# EasyEDA Pro project ProPrj_VL53L0X_1_2026-04-08.epro

# Schematic Schematic1
Create Date: 2026-04-06; Page Name: P1; Project Name: VL53L0X_1; Schematic Name: Schematic1; Update Date: 2026-04-07; Company: EasyEDA.com; Page Size: A4; Version: V1.0
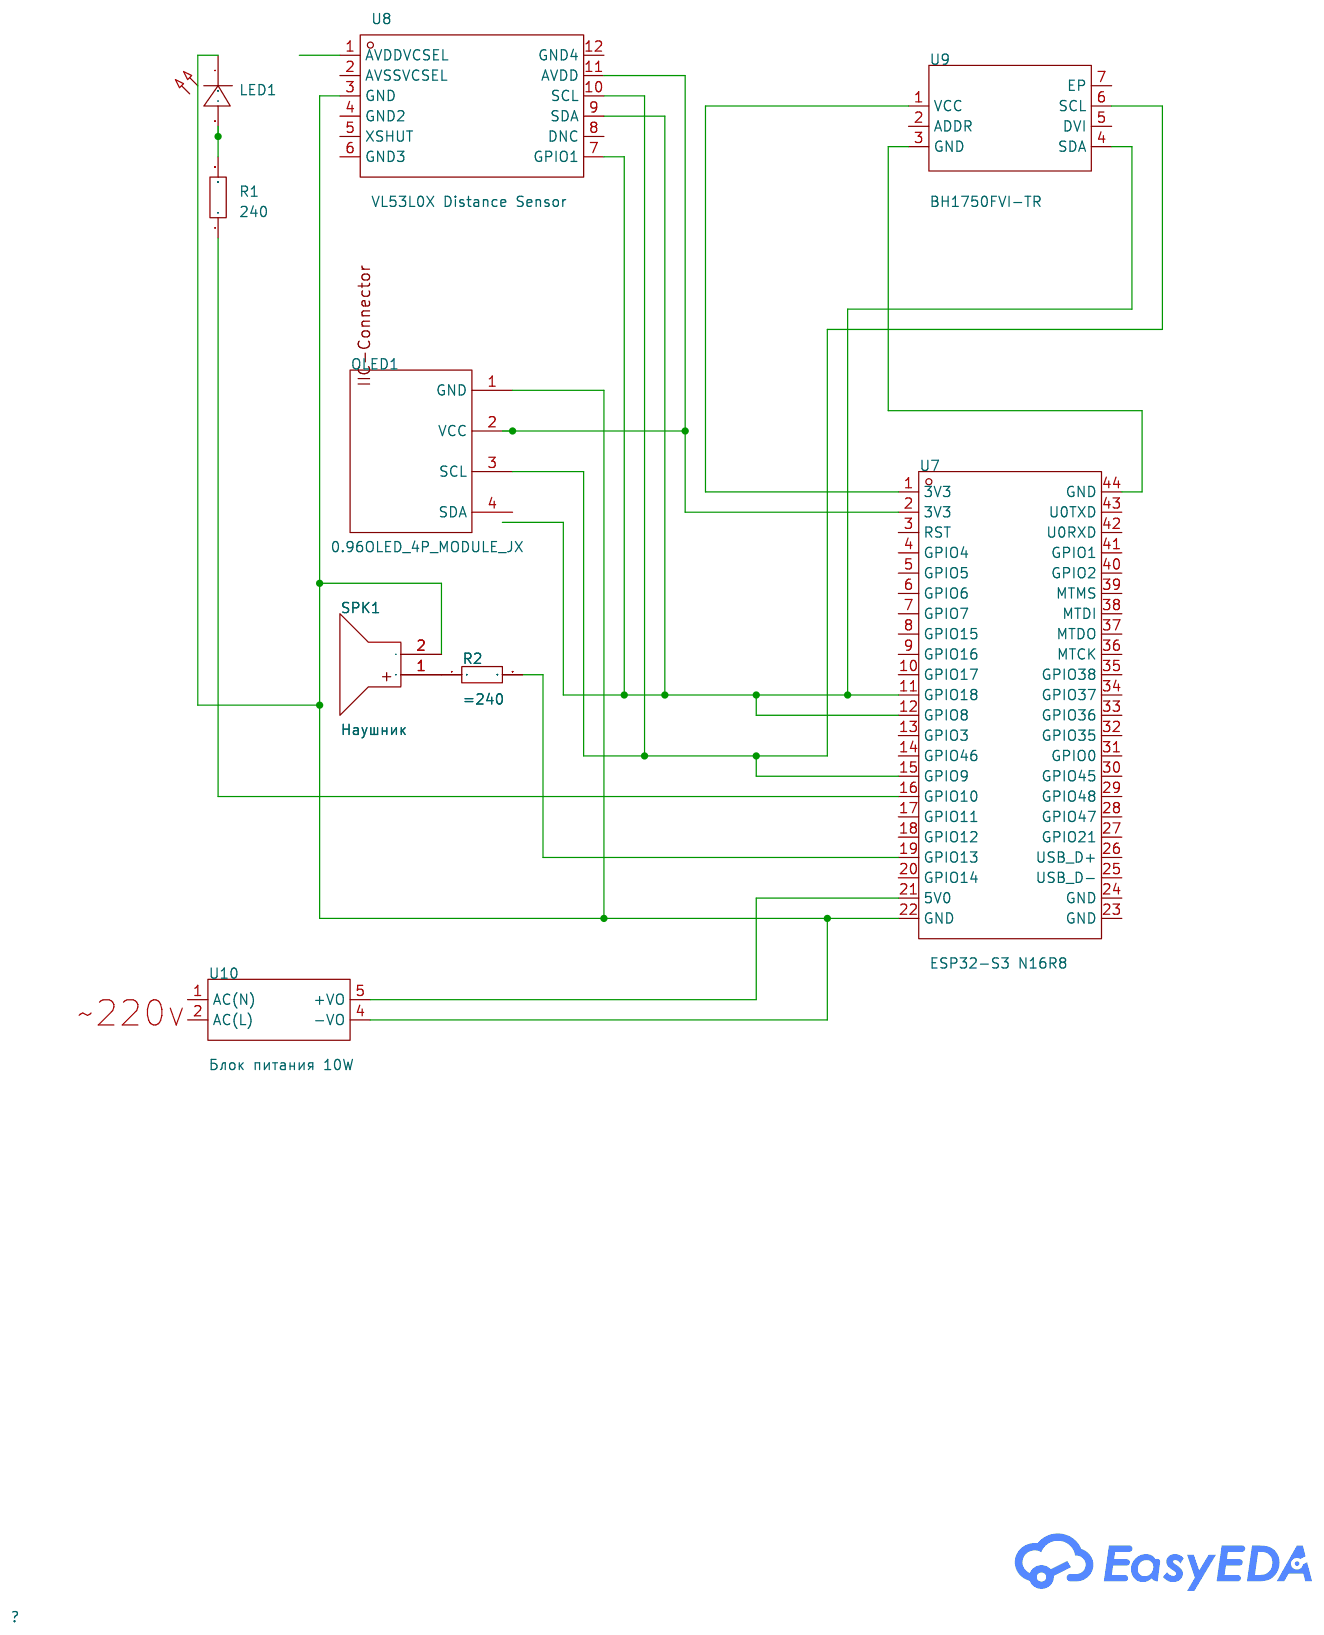
[diagram p0: schematic sheet]

## Parts
LED1  -  [LED0603-RD_GREEN]
OLED1  0.96OLED_4P_MODULE_JX  [0.96OLED_4P]
R1  10K  [R0603]
R2  10K  [R0603]
SPK1  Наушник  [SPK-TH_BD23.0-P10.00-D0.8-L-RD]
U7  ESP32-S3 N16R8  [COMM-TH_L63.3-W25.4-P2.54-LS22.86]
U8  VL53L0X Distance Sensor  [SENSOR-SMD_12P-L4.4-W2.4_VL53L0X]
U9  BH1750FVI-TR  [WSOF-6_L2.6-W1.6-P0.50-TL-EP]
U10  Блок питания 10W  [PWRM-TH_LD05-23BXXR2]

## Library data of the parts
LED1 = LED_0603-G
OLED1 = 0.96OLED_4P_MODULE_JX: Supplier Part: C9900004566; Supplier Footprint: 插件; JLCPCB Part Class: Extended Part; Supplier: LCSC
R1 R2 = Res_0603: Supplier Footprint: 0603
SPK1 = 2308 8Ω1w: Technology:Electromagnetic Frequency Range:1.65kHz~10kHz Frequency Range:1.65kHz~10kHz Impedance:8Ω Resonant Frequency:1.65kHz Rated Power:1W Sound Pressure Level(SPL):88dB Diameter(φD):23mm Height:8mm Operating Temperature:-20℃~+60℃ Operating Temperature; LCSC Part Name: 2308插针喇叭8欧1瓦带腔; Supplier Part: C49304674; Manufacturer: S&S(海旭); Supplier Footprint: 插件,D23xL8mm; JLCPCB Part Class: Extended Part; Datasheet: https://item.szlcsc.com/datasheet/2308%25208%25CE%25A91w/51765047.html; Supplier: LCSC; Technology: Electromagnetic; Frequency Range: 1.65kHz~10kHz; Impedance: 8Ω; Resonant Frequency: 1.65kHz; Rated Power: 1W; Sound Pressure Level(SPL): 88dB; Diameter(φD): 23mm; Height: 8mm; Operating Temperature: -20℃~+60℃; Lead Pitch: 10mm
U7 = ESP32-S3-DEV-KIT-N8R8: Supplier Part: C9900170771; Supplier Footprint: SMD; Supplier: LCSC
U8 = VL53L0X Distance Sensor: LCSC Part Name: 飞行时间 测距传感器模块 2米 I2C接口; Supplier Part: C431944; Manufacturer: Waveshare(微雪电子); JLCPCB Part Class: Extended Part; Datasheet: https://atta.szlcsc.com/upload/public/pdf/source/20190925/C431944_760C760E5F8991C87349673069DEAF55.pdf; Supplier: LCSC
U9 = BH1750FVI-TR: Measurement Type:Light Intensity Photoperceptivity:65.535klx Detection color:- Interface:I2C Voltage - Supply:2.4V~3.6V Voltage - Supply:2.4V~3.6V Quiescent Current:- Operating Temperature:-40℃~+85℃ Operating Temperature:-40℃~+85℃; Supplier Part: C78960; Manufacturer: ROHM(罗姆); Supplier Footprint: WSOF-6; JLCPCB Part Class: Extended Part; Datasheet: https://item.szlcsc.com/datasheet/BH1750FVI-TR/80097.html; Supplier: LCSC; Measurement Type: Light Intensity; Photoperceptivity: 65.535klx; Interface: I2C; Voltage - Supply: 2.4V~3.6V; Operating Temperature: -40℃~+85℃
U10 = LD03-23B12R2_C46594383: Voltage - Input(DC):100V~430V Voltage - Input(DC):100V~430V Voltage - Input(AC):85VAC~305VAC Voltage - Input(AC):85VAC~305VAC Output Voltage:12V Output Voltage:12V Output Voltage Accuracy:±2% Output Voltage Accuracy:±2% Output Current(Max):250mA Output Cu; LCSC Part Name: AC/DC电源模块; Supplier Part: C46594383; Manufacturer: YLPTEC(易川); Manufacturer Part: LD03-23B12R2; Supplier Footprint: 插件,25.4x25.4mm; JLCPCB Part Class: Extended Part; Datasheet: https://item.szlcsc.com/datasheet/LD03-23B12R2/48731745.html; Supplier: LCSC; Voltage - Input(DC): 100V~430V; Voltage - Input(AC): 85VAC~305VAC; Output Voltage: 12V; Output Voltage Accuracy: ±2%; Output Current(Max): 250mA; Output Power: 3W; Quiescent Dissipation: 0.1W; Conversion Efficiency: 78%; Ripple Noise: 60mVp-p; Capacitive Load(Max): 820uF; Features: Short Circuit Protection；Fault self-recovery；Over Current Protection; Isolation Voltage(Vrms): 4kV; Length: 25.4mm; Width: 25.4mm; Height: 17.6mm

## Nets
Net-(LED1-1): LED1.1(C) OLED1.1(GND) SPK1.2(-) U7.22(GND) U8.3(GND) U10.4(-VO)
Net-(LED1-2): LED1.2(A) R1.2
Net-(OLED1-2): OLED1.2(VCC) U7.2(3V3) U8.11(AVDD)
Net-(OLED1-3): OLED1.3(SCL) U7.15(GPIO9) U8.10(SCL) U9.6(SCL)
Net-(R1-1): R1.1 U7.16(GPIO10)
Net-(R2-1): R2.1 SPK1.1(+)
Net-(R2-2): R2.2 U7.19(GPIO13)
Net-(U7-1): U7.1(3V3) U9.1(VCC)
Net-(U7-11): U7.11(GPIO18) U7.12(GPIO8) U8.7(GPIO1) U8.9(SDA) U9.4(SDA)
Net-(U7-21): U7.21(5V0) U10.5(+VO)
Net-(U7-44): U7.44(GND) U9.3(GND)

Not connected (* = marked no-connect by the designer): OLED1 4(SDA); U7 3(RST) 4(GPIO4) 5(GPIO5) 6(GPIO6) 7(GPIO7) 8(GPIO15) 9(GPIO16) 10(GPIO17) 13(GPIO3) 14(GPIO46) 17(GPIO11) 18(GPIO12) 20(GPIO14) 23(GND) 24(GND) 25(USB_D-) 26(USB_D+) 27(GPIO21) 28(GPIO47) 29(GPIO48) 30(GPIO45) 31(GPIO0) 32(GPIO35) 33(GPIO36) 34(GPIO37) 35(GPIO38) 36(MTCK) 37(MTDO) 38(MTDI) 39(MTMS) 40(GPIO2) 41(GPIO1) 42(U0RXD) 43(U0TXD); U8 1(AVDDVCSEL) 2(AVSSVCSEL) 4(GND2) 5(XSHUT) 6(GND3) 8(DNC) 12(GND4); U9 2(ADDR) 5(DVI) 7(EP); U10 1(AC(N)) 2(AC(L))

## Notes on the sheet
- ~220v
